# Altium schematic sheet rev02_11.SchDoc
size 409 x 282 mm
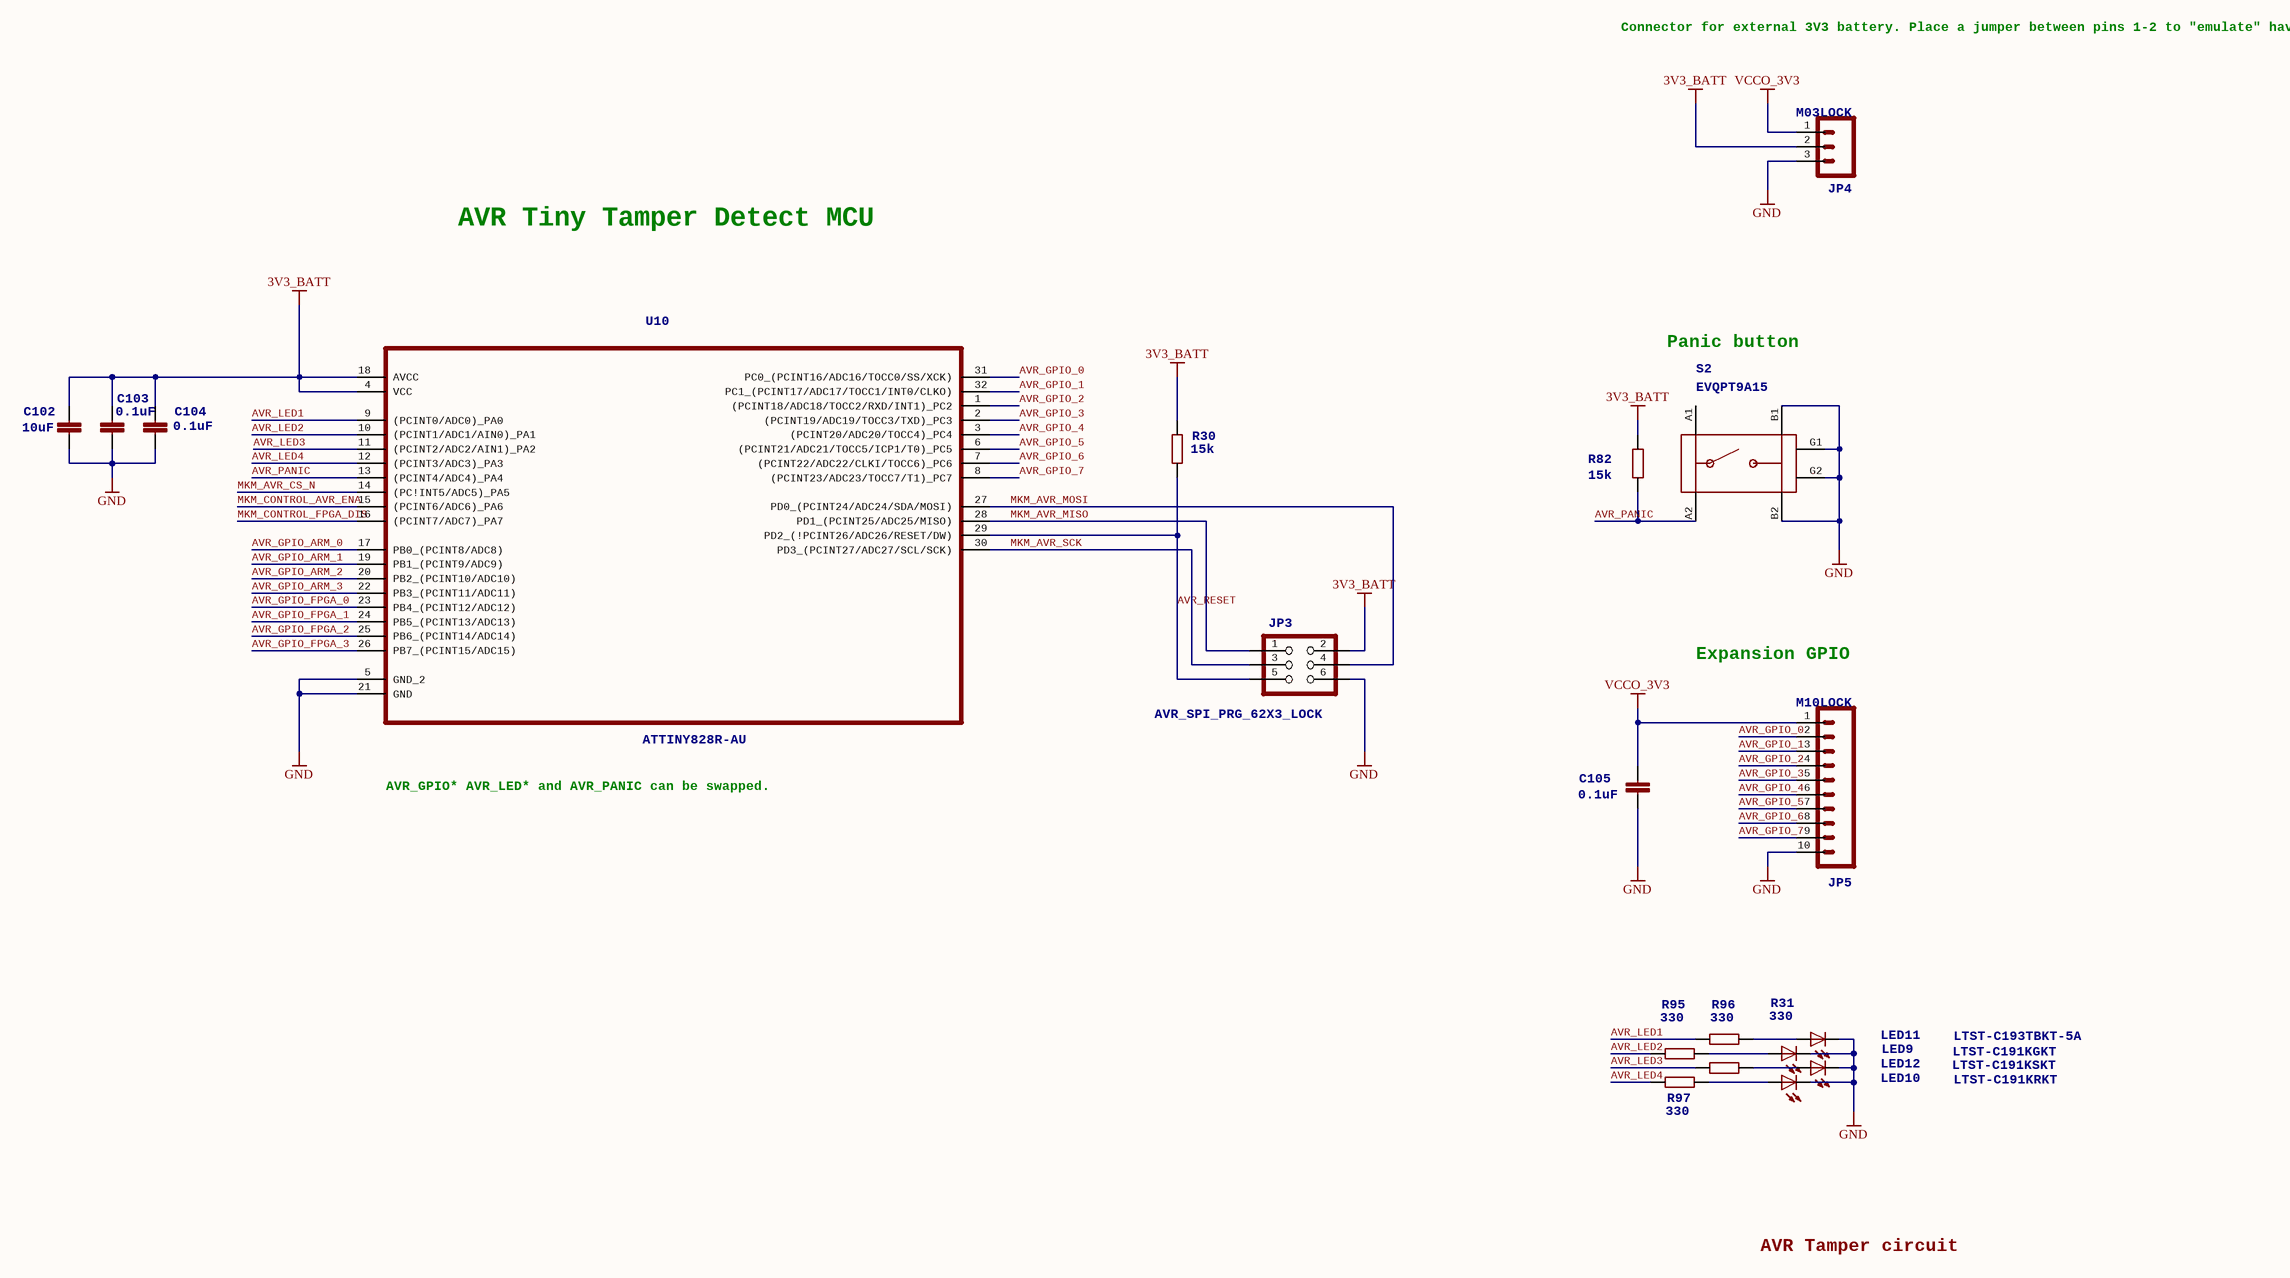
[diagram p0: rev02_11.SchDoc]

## Parts
C102  value 10uF  [C_0805]
C103  value 0.1uF  [C_0402]
C104  value 0.1uF  [C_0402]
C105  value 0.1uF  [C_0402]
JP3  AVR_SPI_PRG_62X3_LOCK  [PLD-6]
JP4  >NAME: JP4  [PLS-3]  (hidden comment: M03LOCK)
JP5  >NAME: JP5  [HDR1X10]  (hidden comment: M10LOCK)
LED9  LTST-C191KGKT  [VD_0603]
LED10  LTST-C191KRKT  [VD_0603]
LED11  LTST-C193TBKT-5A  [VD_0603]
LED12  LTST-C191KSKT  [VD_0603]
R30  value 15k  >NAME: R30  [R_0402]
R31  value 330  [R_0402]
R82  value 15k  [R_0402]
R95  value 330  [R_0402]
R96  value 330  [R_0402]
R97  value 330  [R_0402]
S2  EVQPT9A15  >NAME: S2  [TACTILE_SWITCH]
U10  >NAME: U10  [LQFP-32]  (hidden comment: ATTINY828R-AU)

## Nets
3V3_BATT: C102.1 C103.1 C104.1 JP3.2 JP4.2 R30.2 R82.2 U10.4(VCC) U10.18(AVCC)
GND: C102.2 C103.2 C104.2 C105.2 JP3.6 JP4.3 JP5.10 LED9.2(C) LED10.2(C) LED11.2(C) LED12.2(C) S2.B1 S2.B2 S2.G1 S2.G2 U10.5(GND_2) U10.21(GND)
VCCO_3V3: C105.1 JP4.1 JP5.1
AVR_GPIO_0: JP5.2 U10.31(PC0_(PCINT16/ADC16/TOCC0/SS/XCK))
AVR_GPIO_1: JP5.3 U10.32(PC1_(PCINT17/ADC17/TOCC1/INT0/CLKO))
AVR_GPIO_2: JP5.4 U10.1((PCINT18/ADC18/TOCC2/RXD/INT1)_PC2)
AVR_GPIO_3: JP5.5 U10.2((PCINT19/ADC19/TOCC3/TXD)_PC3)
AVR_GPIO_4: JP5.6 U10.3((PCINT20/ADC20/TOCC4)_PC4)
AVR_GPIO_5: JP5.7 U10.6((PCINT21/ADC21/TOCC5/ICP1/T0)_PC5)
AVR_GPIO_6: JP5.8 U10.7((PCINT22/ADC22/CLKI/TOCC6)_PC6)
AVR_GPIO_7: JP5.9 U10.8((PCINT23/ADC23/TOCC7/T1)_PC7)
AVR_GPIO_ARM_0: U10.17(PB0_(PCINT8/ADC8))
AVR_GPIO_ARM_1: U10.19(PB1_(PCINT9/ADC9))
AVR_GPIO_ARM_2: U10.20(PB2_(PCINT10/ADC10))
AVR_GPIO_ARM_3: U10.22(PB3_(PCINT11/ADC11))
AVR_GPIO_FPGA_0: U10.23(PB4_(PCINT12/ADC12))
AVR_GPIO_FPGA_1: U10.24(PB5_(PCINT13/ADC13))
AVR_GPIO_FPGA_2: U10.25(PB6_(PCINT14/ADC14))
AVR_GPIO_FPGA_3: U10.26(PB7_(PCINT15/ADC15))
AVR_LED1: R96.2 U10.9((PCINT0/ADC0)_PA0)
AVR_LED2: R95.2 U10.10((PCINT1/ADC1/AIN0)_PA1)
AVR_LED3: R31.2 U10.11((PCINT2/ADC2/AIN1)_PA2)
AVR_LED4: R97.2 U10.12((PCINT3/ADC3)_PA3)
AVR_PANIC: R82.1 S2.A2 U10.13((PCINT4/ADC4)_PA4)
AVR_RESET: JP3.5 R30.1 U10.29(PD2_(!PCINT26/ADC26/RESET/DW))
MKM_AVR_CS_N: U10.14((PC!INT5/ADC5)_PA5)
MKM_AVR_MISO: JP3.1 U10.28(PD1_(PCINT25/ADC25/MISO))
MKM_AVR_MOSI: JP3.4 U10.27(PD0_(PCINT24/ADC24/SDA/MOSI))
MKM_AVR_SCK: JP3.3 U10.30(PD3_(PCINT27/ADC27/SCL/SCK))
MKM_CONTROL_AVR_ENA: U10.15((PCINT6/ADC6)_PA6)
MKM_CONTROL_FPGA_DIS: U10.16((PCINT7/ADC7)_PA7)
NetLED9_1: LED9.1(A) R95.1
NetLED10_1: LED10.1(A) R97.1
NetLED11_1: LED11.1(A) R96.1
NetLED12_1: LED12.1(A) R31.1

Not connected (* = marked no-connect by the designer): S2 A1

## Notes on the sheet
- Connector for external 3V3 battery.
  Place a jumper between pins 1-2
  to "emulate" having a battery present.
- AVR Tiny Tamper Detect MCU
- Panic button
- Expansion GPIO
- AVR_GPIO* AVR_LED* and AVR_PANIC can be swapped.
- AVR Tamper circuit

## Library data of the parts
C102 = C-EUC0805: 0805 CAPACITOR
C103-C105 = C-EUC0402: 0402 CAPACITOR
JP3 = AVR_SPI_PRG_62X3_LOCK: AVR ISP 6 Pin. / This is the reduced ISP connector for AVR programming. Common on Arduino. This footprint will take up less PCB space and can be used with a 10-pin to 6-pin adapter such as SKU: BOB-08508. *Special note about "TEST_POINT" package. The stop mask is on the top side, so if you want your programming test points to be on the bottom of your board, make sure to place this package on the bottom side of the board. This also ensure that the orientation to program from the bottom side will be correct.
JP4 = M03LOCK: Standard 3-pin 0.1" header. Use with straight break away headers (SKU : PRT-00116), right angle break away headers (PRT-00553), swiss pins (PRT-00743), machine pins (PRT-00117), and female headers (PRT-00115). Molex polarized connector foot print use with SKU : PRT-08232 with associated crimp pins and housings.; >VALUE: M03LOCK
JP5 = M10LOCK: Standard 10-pin 0.1" header. Use with straight break away headers (SKU : PRT-00116), right angle break away headers (PRT-00553), swiss pins (PRT-00743), machine pins (PRT-00117), and female headers (PRT-00115).; >VALUE: M10LOCK
LED9 = LEDCHIP-LED0603: GREEN LED
LED10 = LEDCHIP-LED0603: RED LED
LED11 = LEDCHIP-LED0603: BLUE LED
LED12 = LEDCHIP-LED0603: YELLOW LED
R30 R31 R82 R95-R97 = R-EU_R0402: 0402 Resistor 5%
S2 = TACTILE_SWITCH: Tacktile switch; OC_FARNELL: 2425618
U10 = ATTINY828R-AU: IC, MCU, 8KB, FLASH, 20MHZ, TQFP-32; MPN: ATTINY828R-AU; OC_FARNELL: 2249850; OC_NEWARK: Unknown; PACKAGE: TQFP-32; SUPPLIER: ATMEL; >VALUE: ATTINY828R-AU